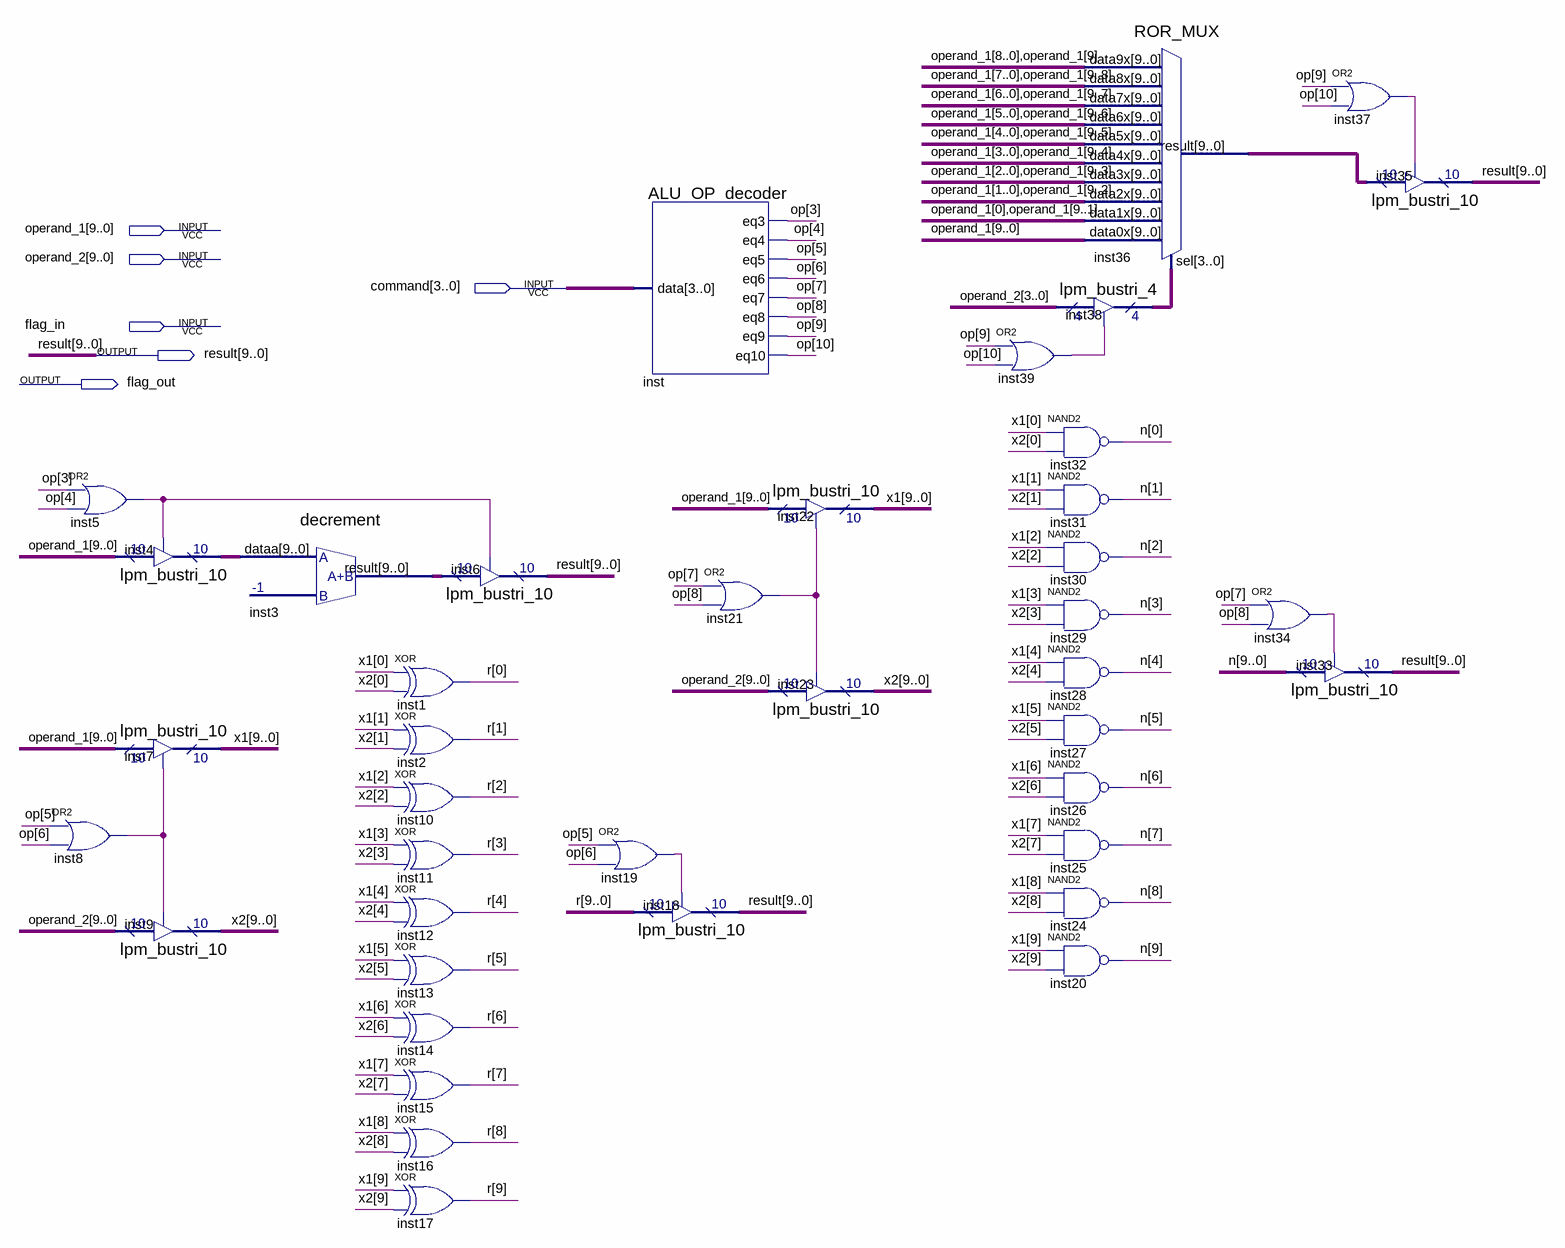
[diagram p0: schematic sheet]
// Quartus schematic ALU.bdf as structural Verilog: 40 symbols, 6 pins
module ALU (
  input  [9:0] operand_1,
  input  [9:0] operand_2,
  input  [3:0] command,
  input  flag_in,
  output [9:0] result,
  output flag_out
);

  wire inst5_out, inst8_out, inst19_out, inst21_out, inst34_out, inst37_out, inst39_out;
  wire [3:0] inst38_tridata;
  wire [9:0] inst3_result, inst4_tridata, inst36_result, n, r, x1, x2;
  wire [10:3] op;

  or inst5 (inst5_out, op[3], op[4]);
  or inst8 (inst8_out, op[5], op[6]);
  lpm_bustri_10 inst4 (.enabledt(inst5_out), .data(operand_1), .tridata(inst4_tridata));
  lpm_bustri_10 inst7 (.enabledt(inst8_out), .data(operand_1), .tridata(x1));
  lpm_bustri_10 inst9 (.enabledt(inst8_out), .data(operand_2), .tridata(x2));
  decrement inst3 (.dataa(inst4_tridata), .result(inst3_result));
  xor inst1 (r[0], x1[0], x2[0]);
  xor inst2 (r[1], x1[1], x2[1]);
  xor inst10 (r[2], x1[2], x2[2]);
  xor inst11 (r[3], x1[3], x2[3]);
  xor inst12 (r[4], x1[4], x2[4]);
  xor inst13 (r[5], x1[5], x2[5]);
  xor inst14 (r[6], x1[6], x2[6]);
  xor inst15 (r[7], x1[7], x2[7]);
  xor inst16 (r[8], x1[8], x2[8]);
  xor inst17 (r[9], x1[9], x2[9]);
  lpm_bustri_10 inst6 (.enabledt(inst5_out), .data(inst3_result), .tridata(result));
  or inst19 (inst19_out, op[5], op[6]);
  ALU_OP_decoder inst (
    .data(command), .eq3(op[3]), .eq4(op[4]), .eq5(op[5]), .eq6(op[6]), .eq7(op[7]), .eq8(op[8]),
    .eq9(op[9]), .eq10(op[10]));
  or inst21 (inst21_out, op[7], op[8]);
  lpm_bustri_10 inst18 (.enabledt(inst19_out), .data(r), .tridata(result));
  lpm_bustri_10 inst22 (.enabledt(inst21_out), .data(operand_1), .tridata(x1));
  lpm_bustri_10 inst23 (.enabledt(inst21_out), .data(operand_2), .tridata(x2));
  or inst39 (inst39_out, op[9], op[10]);
  ROR_MUX inst36 (
    .data9x({operand_1[8:0], operand_1[9]}), .data8x({operand_1[7:0], operand_1[9:8]}),
    .data7x({operand_1[6:0], operand_1[9:7]}), .data6x({operand_1[5:0], operand_1[9:6]}),
    .data5x({operand_1[4:0], operand_1[9:5]}), .data4x({operand_1[3:0], operand_1[9:4]}),
    .data3x({operand_1[2:0], operand_1[9:3]}), .data2x({operand_1[1:0], operand_1[9:2]}),
    .data1x({operand_1[0], operand_1[9:1]}), .data0x(operand_1), .sel(inst38_tridata), .result(inst36_result));
  lpm_bustri_4 inst38 (.enabledt(inst39_out), .data(operand_2[3:0]), .tridata(inst38_tridata));
  nand inst32 (n[0], x1[0], x2[0]);
  nand inst31 (n[1], x1[1], x2[1]);
  nand inst30 (n[2], x1[2], x2[2]);
  nand inst29 (n[3], x1[3], x2[3]);
  nand inst28 (n[4], x1[4], x2[4]);
  nand inst27 (n[5], x1[5], x2[5]);
  nand inst26 (n[6], x1[6], x2[6]);
  nand inst25 (n[7], x1[7], x2[7]);
  nand inst24 (n[8], x1[8], x2[8]);
  nand inst20 (n[9], x1[9], x2[9]);
  or inst34 (inst34_out, op[7], op[8]);
  lpm_bustri_10 inst33 (.enabledt(inst34_out), .data(n), .tridata(result));
  or inst37 (inst37_out, op[9], op[10]);
  lpm_bustri_10 inst35 (.enabledt(inst37_out), .data(inst36_result), .tridata(result));
endmodule
